# Altium schematic sheet QSFP.SchDoc: QSFP
size 420 x 297 mm; DocumentNumber: 8; SheetNumber: 4; SheetTotal: 15
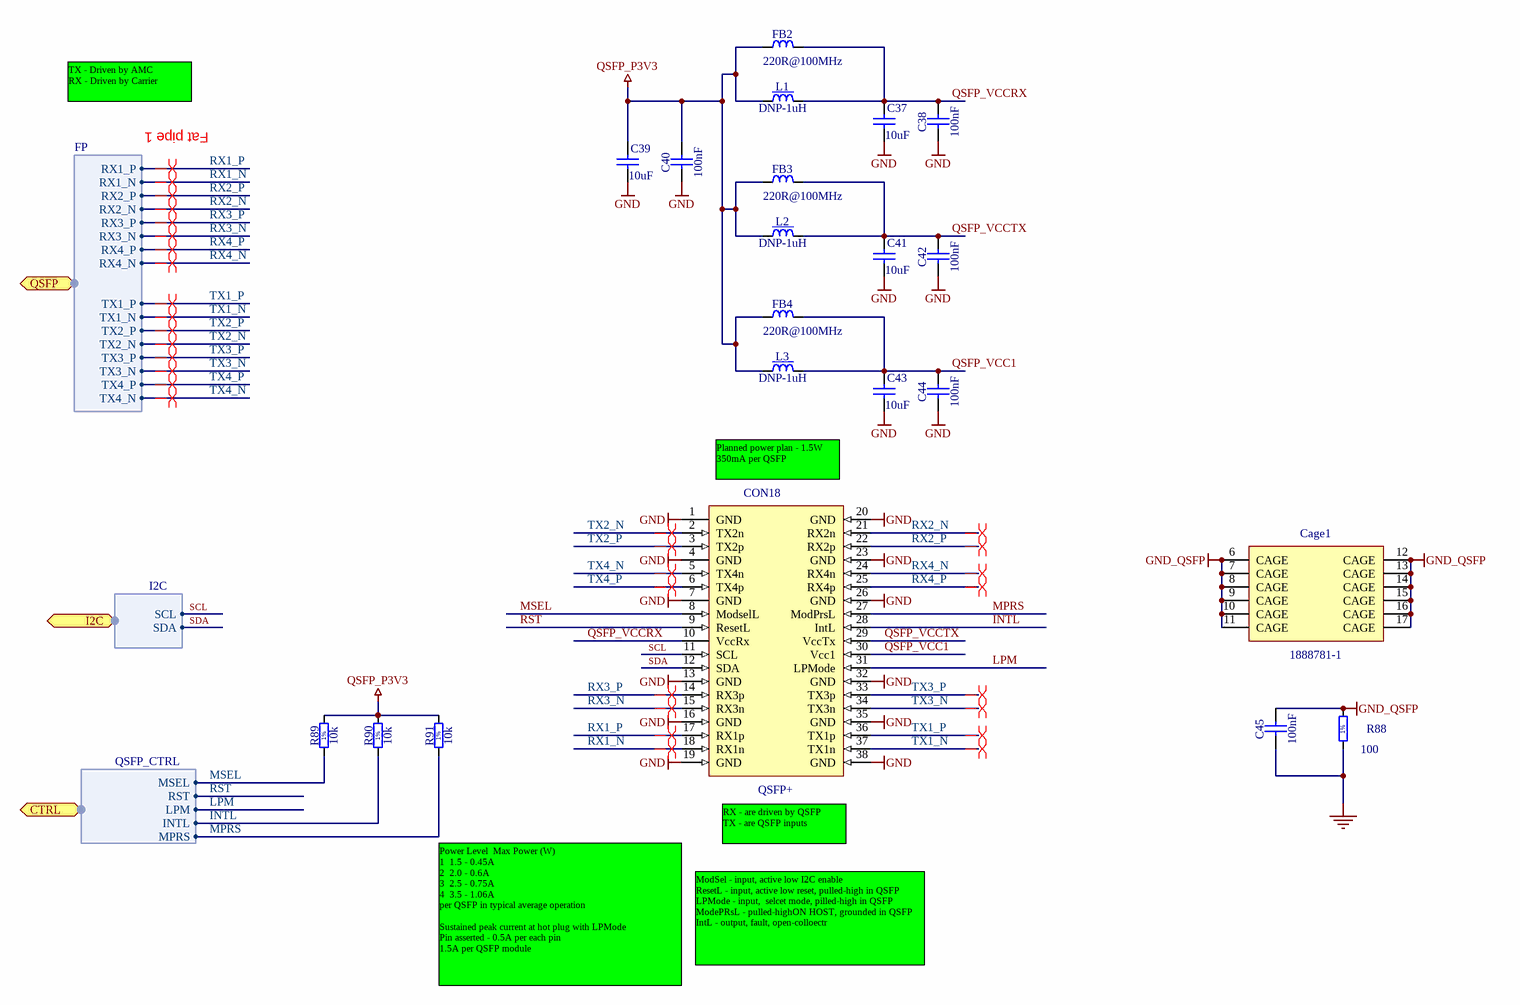
[diagram p0: QSFP.SchDoc]

## Parts
C37  10uF  [CAPC2012X135N]
C38  100nF  [CAPC1005X55N]
C39  10uF  [CAPC2012X135N]
C40  100nF  [CAPC1005X55N]
C41  10uF  [CAPC2012X135N]
C42  100nF  [CAPC1005X55N]
C43  10uF  [CAPC2012X135N]
C44  100nF  [CAPC1005X55N]
C45  100nF  [CAPC1005X55N]
Cage1  1888781-1  [TYCO_1888781-1]
CON18  QSFP+  [TYCO_1761987-9]
FB2  220R@100MHz  [INDC2012X105N]
FB3  220R@100MHz  [INDC2012X105N]
FB4  220R@100MHz  [INDC2012X105N]
L1  DNP-1uH  [IND_MURATA_LQH32]
L2  DNP-1uH  [IND_MURATA_LQH32]
L3  DNP-1uH  [IND_MURATA_LQH32]
R88  100  [RESC1005X40N]
R89  10k  [RESC1005X40N]
R90  10k  [RESC1005X40N]
R91  10k  [RESC1005X40N]

## Ports
CTRL (harness QSFP_CTRL), I2C (harness I2C), QSFP (harness FP)

## Harnesses
I2C: SCL, SDA
FP: RX1_P, RX1_N, RX2_N, RX2_P, TX1_P, TX1_N, TX2_N, TX2_P, RX3_P, RX3_N, RX4_N, RX4_P, TX3_P, TX3_N, TX4_N, TX4_P
QSFP_CTRL: RST, MPRS, MSEL, LPM, INTL

## Nets
GND: C37.2 C38.1 C39.2 C40.1 C41.2 C42.1 C43.2 C44.1 C45.1 CON18.1(GND) CON18.4(GND) CON18.7(GND) CON18.13(GND) CON18.16(GND) CON18.19(GND) CON18.20(GND) CON18.23(GND) CON18.26(GND) CON18.32(GND) CON18.35(GND) CON18.38(GND) R88.1
GND_QSFP: C45.2 Cage1.6(CAGE) Cage1.7(CAGE) Cage1.8(CAGE) Cage1.9(CAGE) Cage1.10(CAGE) Cage1.11(CAGE) Cage1.12(CAGE) Cage1.13(CAGE) Cage1.14(CAGE) Cage1.15(CAGE) Cage1.16(CAGE) Cage1.17(CAGE) R88.2
QSFP_P3V3: C39.1 C40.2 FB2.1 FB3.1 FB4.1 L1.1 L2.1 L3.1 R89.2 R90.2 R91.2
INTL: CON18.28(IntL) R90.1 ; port CTRL.INTL
LPM: CON18.31(LPMode) ; port CTRL.LPM
MPRS: CON18.27(ModPrsL) R91.1 ; port CTRL.MPRS
MSEL: CON18.8(ModselL) R89.1 ; port CTRL.MSEL
QSFP_VCC1: C43.1 C44.2 CON18.30(Vcc1) FB4.2 L3.2
QSFP_VCCRX: C37.1 C38.2 CON18.10(VccRx) FB2.2 L1.2
QSFP_VCCTX: C41.1 C42.2 CON18.29(VccTx) FB3.2 L2.2
RST: CON18.9(ResetL) ; port CTRL.RST
RX1_N: CON18.18(RX1n) ; port QSFP.RX1_N
RX1_P: CON18.17(RX1p) ; port QSFP.RX1_P
RX2_N: CON18.21(RX2n) ; port QSFP.RX2_N
RX2_P: CON18.22(RX2p) ; port QSFP.RX2_P
RX3_N: CON18.15(RX3n) ; port QSFP.RX3_N
RX3_P: CON18.14(RX3p) ; port QSFP.RX3_P
RX4_N: CON18.24(RX4n) ; port QSFP.RX4_N
RX4_P: CON18.25(RX4p) ; port QSFP.RX4_P
SCL: CON18.11(SCL) ; port I2C.SCL
SDA: CON18.12(SDA) ; port I2C.SDA
TX1_N: CON18.37(TX1n) ; port QSFP.TX1_N
TX1_P: CON18.36(TX1p) ; port QSFP.TX1_P
TX2_N: CON18.2(TX2n) ; port QSFP.TX2_N
TX2_P: CON18.3(TX2p) ; port QSFP.TX2_P
TX3_N: CON18.34(TX3n) ; port QSFP.TX3_N
TX3_P: CON18.33(TX3p) ; port QSFP.TX3_P
TX4_N: CON18.5(TX4n) ; port QSFP.TX4_N
TX4_P: CON18.6(TX4p) ; port QSFP.TX4_P

## Layout directives
differential pair: RX1_N, RX1_P, RX2_N, RX2_P, RX3_N, RX3_P, RX4_N, RX4_P, TX1_N, TX1_P, TX2_N, TX2_P, TX3_N, TX3_P, TX4_N, TX4_P

## Notes on the sheet
- TX - Driven by AMC
  RX - Driven by Carrier
- Fat pipe 1
- Planned power plan - 1.5W
  350mA per QSFP
- (near CON18) RX - are driven by QSFP
  TX - are QSFP inputs
- ModSel - input, active low I2C enable
  ResetL - input, active low reset, pulled-high in QSFP
  LPMode - input,  selcet mode, pilled-high in QSFP
  ModePRsL - pulled-highON HOST, grounded in QSFP
  IntL - output, fault, open-colloectr
- Power Level  Max Power (W)
  1  1.5 - 0.45A
  2  2.0 - 0.6A
  3  2.5 - 0.75A
  4  3.5 - 1.06A
  per QSFP in typical average operation
  Sustained peak current at hot plug with LPMode
  Pin asserted - 0.5A per each pin
  1.5A per QSFP module
- Project/Equipment
- Document
- uTCA RTM 8 SFP+
- Designer
- Drawn by
- Check.by
- Copyright Creotech Instruments SA 2014.
  This documentation describes Open Hardware and is licensed under the CERN OHL v.1.1. You may redistribute and modify this documentation under the terms of the CERN OHL v.1.1. (http://ohwr.org/CERNOHL). This documentation is distributed WITHOUT ANY EXPRESS OR IMPLIED WARRANTY, INCLUDING OF MERCHANTABILITY, SATISFACTORY QUALITY AND FITNESS FOR A PARTICULAR PURPOSE. Please see the CERN OHL v.1.1 for applicable conditions.
- Creotech Instruments S.A.
- File
- Last Mod.
- Print Date
- Sheet
- Size
- A3
- of
- Rev
- (in symbol R0402_10K_1%_0.0625W_100PPM) 1%
- (in symbol R0402_100R_1%_0.0625W_100PPM) 1%

## Library data of the parts
C37 C39 C41 C43 = CC0805_10UF_10V_10%_X7R: Non-polarised capacitor; Part Description: SMD Multilayer Chip Ceramic Capacitor; Manufacturer: GENERIC; Manufacturer1 Part Number: GRM21BR71A106KE51L; Voltage: 10V; TC: X7R; Tolerance: ±10%; Table: Capacitors SMD; Part Number: CC0805_10UF_10V_10%_X7R; Component Kind: Standard; Component Type: Standard; Pin Count: 2; Value: 10uF; Status: Preferred; Manufacturer Part Number: CC0805_10UF_10V_10%_X7R; Case: 0805; Mounted: Yes; Socket: No; SMD: Yes; Manufacturer1 Example: MURATA; Manufacturer1 ComponentHeight: 1.35mm; HelpURL: \\cern.ch\dfs\Applications\Altium\Datasheets\CC0805_X7R_MURATA.pdf; Author: CERN DEM JLC; CreateDate: 2012-04-30; LatestRevisionDate: 2012-04-30
C38 C40 C42 C44 C45 = CC0402_100NF_16V_10%_X5R: Non-polarised capacitor; Part Description: SMD Multilayer Chip Ceramic Capacitor; Manufacturer: GENERIC; Manufacturer1 Part Number: GRM155R61C104KA88D; Voltage: 16V; TC: X5R; Tolerance: ±10%; Table: Capacitors SMD; Part Number: CC0402_100NF_16V_10%_X5R; Component Kind: Standard; Component Type: Standard; Pin Count: 2; Value: 100nF; Status: None; Manufacturer Part Number: CC0402_100NF_16V_10%_X5R; Case: 0402; Mounted: Yes; Socket: No; SMD: Yes; Manufacturer1 Example: MURATA; Manufacturer1 ComponentHeight: 0.55mm; HelpURL: \\cern.ch\dfs\Applications\Altium\Datasheets\CC0402_X5R_MURATA_GRM.pdf; Author: CERN DEM JLC; CreateDate: 2013-12-10; LatestRevisionDate: 2013-12-10
Cage1 = CON_QSFP+_cage: QSFP+ 1x3 Cage (23Pins); Part Number: TYCO_2007456-1; Part Description: 1x3 Press Fit Cage+ Heat Sink For Use with QSFP+ Connector (Quad Small Form-factor Pluggable); Manufacturer: TYCO ELECTRONICS; Manufacturer Part Number: 2007456-1; Table: TYCO; Component Kind: Standard; Component Type: Standard; Footprint: TYCO_2007456-1; Pin Count: 23; Family: QSFP+; Mounted: Yes; Socket: No; SMD: No; Status: None; ComponentHeight: 13.2mm; HelpURL: \\cern.ch\dfs\Applications\Altium\Datasheets\TYCO_2007456-1.pdf; Author: CERN DEM JLC; CreateDate: 2013-07-15; LatestRevisionDate: 2013-07-15
CON18 = TYCO_1761987-9: 38Position QSFP Connector  (Quad Small Form-factor Pluggable); Part Description: Surface Mount EVERCLEAR Mini-SAS Right Angle QSFP Host Connector; Manufacturer: TYCO ELECTRONICS; Table: TYCO; Part Number: TYCO_1761987-9; Component Kind: Standard; Component Type: Standard; Pin Count: 38; Family: QSFP+; Mounted: Yes; Socket: No; SMD: No; Status: None; Manufacturer Part Number: 1761987-9; ComponentHeight: 5.55mm; HelpURL: \\cern.ch\dfs\Applications\Altium\Datasheets\TYCO_1761987-9.pdf; Author: CERN DEM JLC; CreateDate: 2013-07-15; LatestRevisionDate: 2013-07-15
FB2-FB4 = IND0805_MURATA_BLM21PG221SN1D: Inductor; Part Description: SMD EMIFIL Suppression Chip Ferrite Bead; Manufacturer: MURATA; Power: 2A; Resistance: 0.05R; Tolerance: ±25%; Table: Inductors SMD; Part Number: IND0805_MURATA_BLM21PG221SN1D; Component Kind: Standard; Component Type: Standard; Pin Count: 2; Value: 220R@100MHz; Status: None; Manufacturer Part Number: BLM21PG221SN1D; Case: 0805; Mounted: Yes; Socket: No; SMD: Yes; ComponentHeight: 1.05mm; HelpURL: \\cern.ch\dfs\Applications\Altium\Datasheets\IND0402_MURATA_BLM21P.pdf; Author: CERN DEM JLC; CreateDate: 2010-01-25; LatestRevisionDate: 2010-01-25
L1-L3 = IND_1UH_20%_MURATA_LQH32CN1R0M33: Inductor With Magnetic core; Part Description: Chip Inductor (Chip Coil) for Choke Wire Wound Type; Manufacturer: MURATA; Manufacturer Part Number: LQH32CN1R0M33L; Power: 1A; Resistance: 0.06R; Tolerance: ±20%; Table: Inductors SMD; Part Number: IND_1UH_20%_MURATA_LQH32CN1R0M33; Component Kind: Standard; Component Type: Standard; Pin Count: 2; Value: DNP-1uH; Status: None; Mounted: Yes; Socket: No; SMD: Yes; ComponentHeight: 2.2mm; HelpURL: \\cern.ch\dfs\Applications\Altium\Datasheets\IND_MURATA_LQH32.pdf; Author: CERN DEM JLC; CreateDate: 2012-08-14; LatestRevisionDate: 2012-08-20
R88 = R0402_100R_1%_0.0625W_100PPM: Resistor - 1%; Part Description: General Purpose Thick Film Chip Resistor; Manufacturer: GENERIC; Manufacturer1 Part Number: 232270671001L; TC: ±100ppm/°C; Table: Resistors SMD; Part Number: R0402_100R_1%_0.0625W_100PPM; Component Kind: Standard; Component Type: Standard; Pin Count: 2; Value: 100; Status: Not recommended; Power: 0.0625W; Tolerance: ±1%; Manufacturer Part Number: R0402_100R_1%_0.0625W_100PPM; Case: 0402; Mounted: Yes; Socket: No; SMD: Yes; Manufacturer1 Example: YAGEO PHYCOMP; Manufacturer1 ComponentHeight: 0.4mm; HelpURL: \\cern.ch\dfs\Applications\Altium\Datasheets\R0402_Phycomp_RC0402.pdf; Author: CERN DEM JLC; CreateDate: 2007-12-03; LatestRevisionDate: 2012-10-17
R89-R91 = R0402_10K_1%_0.0625W_100PPM: Resistor - 1%; Part Description: General Purpose Thick Film Chip Resistor; Manufacturer: GENERIC; Manufacturer1 Part Number: 232270671003L; TC: ±100ppm/°C; Table: Resistors SMD; Part Number: R0402_10K_1%_0.0625W_100PPM; Component Kind: Standard; Component Type: Standard; Pin Count: 2; Value: 10k; Status: Not recommended; Power: 0.0625W; Tolerance: ±1%; Manufacturer Part Number: R0402_10K_1%_0.0625W_100PPM; Case: 0402; Mounted: Yes; Socket: No; SMD: Yes; Manufacturer1 Example: YAGEO PHYCOMP; Manufacturer1 ComponentHeight: 0.4mm; HelpURL: \\cern.ch\dfs\Applications\Altium\Datasheets\R0402_Phycomp_RC0402.pdf; Author: CERN DEM JLC; CreateDate: 2007-12-03; LatestRevisionDate: 2012-10-17